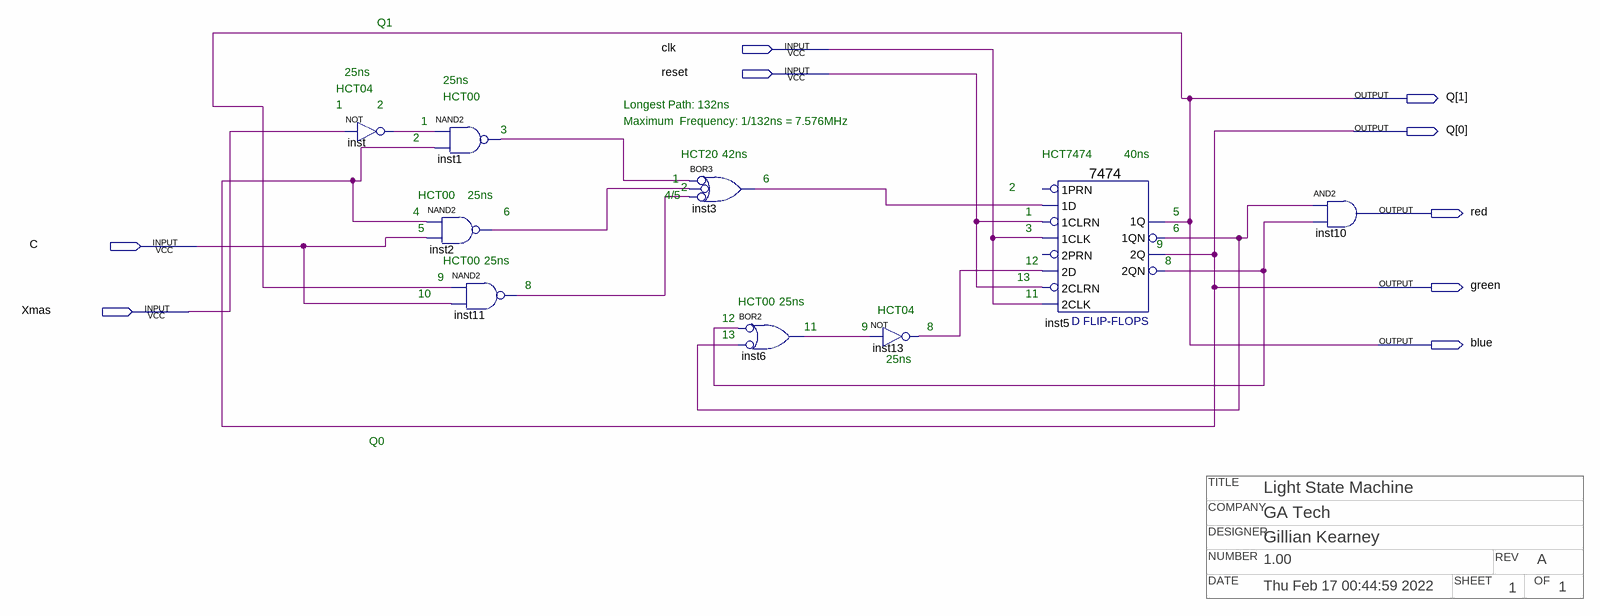
[diagram p0: schematic sheet]
// Quartus schematic StateMachineSchematic.bdf as structural Verilog: 9 symbols, 9 pins
// Title block: COMPANY: GA Tech; DATE: Thu Feb 17 00:44:59 2022; DESIGNER: Gillian Kearney; NUMBER: 1.00; OF: 1; REV: A; SHEET: 1; TITLE: Light State Machine
module StateMachineSchematic (
  input  clk,
  input  reset,
  input  C,
  input  Xmas,
  output [1:0] Q,
  output red,
  output green,
  output blue
);

  wire inst1_out, inst2_out, inst3_out, inst5_1qn, inst5_2qn, inst6_out, inst11_out, inst13_out, inst_out;

  not inst (inst_out, Xmas);
  nand inst1 (inst1_out, inst_out, green);
  nand inst2 (inst2_out, green, C);
  nand inst11 (inst11_out, blue, C);
  or inst3 (inst3_out, ~inst1_out, ~inst2_out, ~inst11_out);  // BOR3
  or inst6 (inst6_out, ~inst5_2qn, ~inst5_1qn);  // BOR2
  not inst13 (inst13_out, inst6_out);
  \7474  inst5 (
    .\2D (inst13_out), .\1CLK (clk), .\1D (inst3_out), .\2CLK (clk), .\2CLRN (reset), .\1CLRN (reset),
    .\1QN (inst5_1qn), .\2Q (green), .\2QN (inst5_2qn), .\1Q (blue));  // open: 2PRN, 1PRN
  and inst10 (red, inst5_1qn, inst5_2qn);

  assign Q = {blue, green};

  // Notes on the sheet:
  //   Q1
  //   25ns
  //   25ns
  //   HCT04
  //   HCT00
  //   1
  //   2
  //   Longest Path: 132ns
  //    1
  //   Maximum  Frequency: 1/132ns = 7.576MHz
  //   3
  //    2
  //   HCT20
  //   42ns
  //   HCT7474
  //   40ns
  //   1
  //   6
  //   2
  //   2
  //   HCT00
  //   25ns
  //   4/5
  //    4
  //    6
  //   1
  //   5
  //   5
  //   3
  //   6
  //   9
  //   HCT00
  //   25ns
  //   12
  //   8
  //    9
  //   13
  //   8
  //   10
  //   11
  //   HCT00
  //   25ns
  //   HCT04
  //   12
  //   11
  //   9
  //   8
  //   13
  //   25ns
  //   Q0
endmodule
